# EAGLE design supertrack (EAGLE 7.0.0)
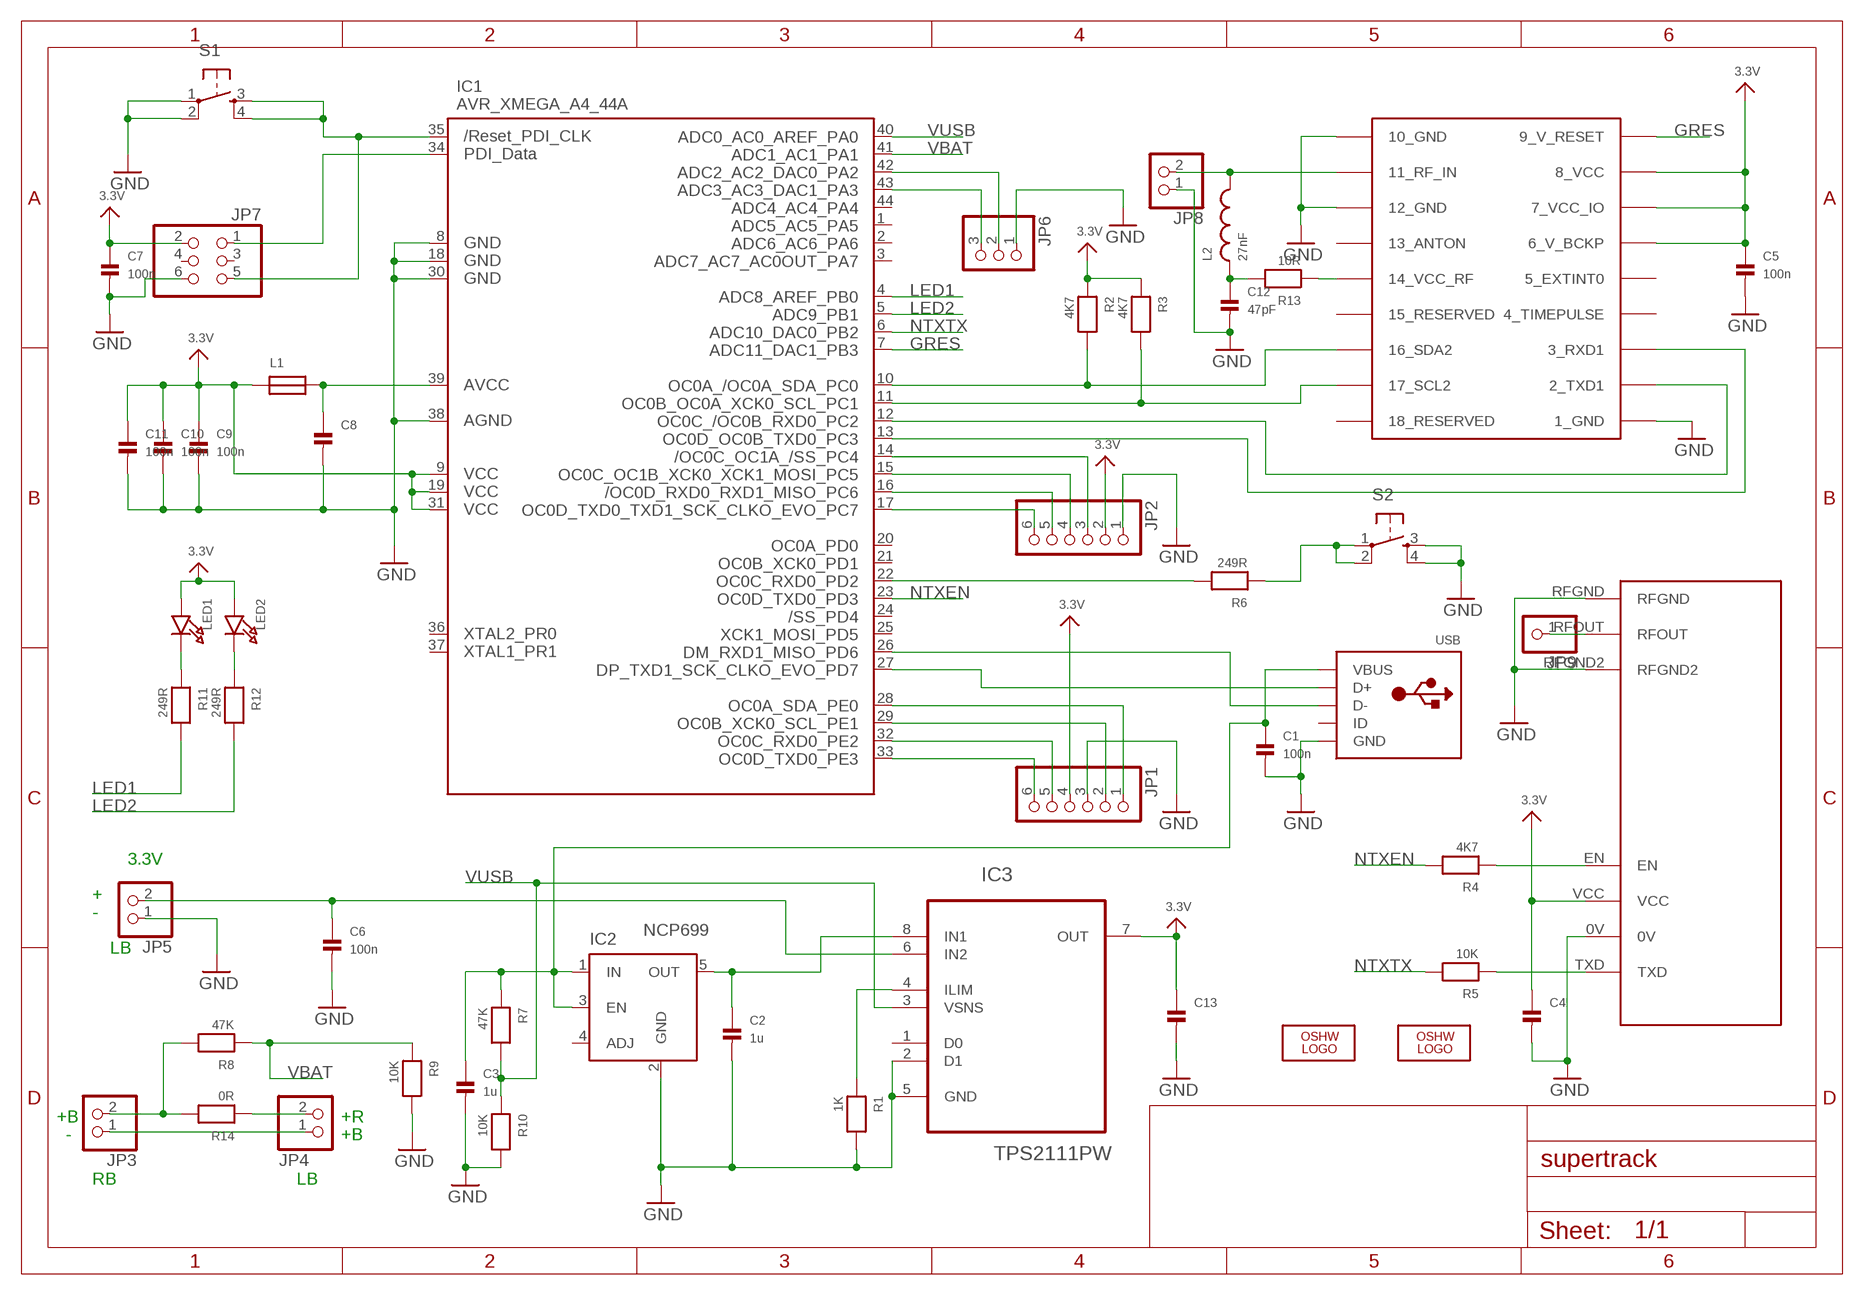
[diagram p0: schematic, sheet 1]

## Parts
C1  100n  CAP_CERAMIC0603  [0603]
C2  1u  CAP_CERAMIC0603  [0603]
C3  1u  CAP_CERAMIC0603  [0603]
C4  CAP_CERAMIC0603  [0603]
C5  100n  CAP_CERAMIC0603  [0603]
C6  100n  CAP_CERAMIC0603  [0603]
C7  100n  CAP_CERAMIC0603  [0603]
C8  CAP_CERAMIC0603  [0603]
C9  100n  CAP_CERAMIC0603  [0603]
C10  100n  CAP_CERAMIC0603  [0603]
C11  100n  CAP_CERAMIC0603  [0603]
C12  47pF  CAP_CERAMIC0603  [0603]
C13  CAP_CERAMIC0603  [0603]
IC1  AVR_XMEGA_A4_44A  [TQFP44]
IC2  NCP699  MIC5219BM5  [SOT23-5]
IC3  TPS2111PW  [SOP65P640X120-8N]
JP1  PINHD-1X6  [1X06]
JP2  PINHD-1X6  [1X06]
JP3  PINHD-1X2  [1X02]
JP4  PINHD-1X2  [1X02]
JP5  PINHD-1X2  [1X02]
JP6  PINHD-1X3  [1X03]
JP7  PINHD-2X3  [2X03]
JP8  HEADER-1X2ROUND  [1X02_ROUND]
JP9  HEADER-1X1ROUND  [1X01_ROUND]
L1  FERRITE  [0603]
L2  27nF  INDUCTOR0603  [0603]
LED1  LED0603  [CHIPLED_0603]
LED2  LED0603  [CHIPLED_0603]
LOGO1  OSHW_LOGO_8MILX0150-NT  [OSHW_8X150_NOTEXT]
LOGO2  OSHW_LOGO_8MILX0100-NT  [OSHW_8X100_NOTEXT]
R1  1K  RESISTOR0603  [0603]
R2  4K7  RESISTOR0603  [0603]
R3  4K7  RESISTOR0603  [0603]
R4  4K7  RESISTOR0603  [0603]
R5  10K  RESISTOR0603  [0603]
R6  249R  RESISTOR0603  [0603]
R7  47K  RESISTOR0603  [0603]
R8  47K  RESISTOR0603  [0603]
R9  10K  RESISTOR0603  [0603]
R10  10K  RESISTOR0603  [0603]
R11  249R  RESISTOR0603  [0603]
R12  249R  RESISTOR0603  [0603]
R13  10R  RESISTOR0603  [0603]
R14  0R  RESISTOR0603  [0603]
S1  TAC_SWITCHSMD  [TACTILE_SWITCH_SMD]
S2  TAC_SWITCHSMD  [TACTILE_SWITCH_SMD]
U$1  NTX2  [NTX2]
U$2  UBLOX_MAX  [UBLOX_MAX]
USB  USBMINIB  [USB-MINIB]

## Nets
3.3V: C4.1 C5.1 C7.1 C9.1 C10.1 C11.1 C13.1 IC1.9(VCC1) IC1.19(VCC2) IC1.31(VCC3) IC3.7(OUT) JP1.4 JP2.2 JP7.2 L1.1 LED1.A LED2.A R2.1 R3.1 U$1.VCC U$2.6_V_BCKP U$2.7_VCC_IO U$2.8_VCC
GND: C1.2 C2.2 C3.2 C4.2 C5.2 C6.2 C7.2 C8.2 C9.2 C10.2 C11.2 C12.2 C13.2 IC1.8(GND1) IC1.18(GND2) IC1.30(GND3) IC1.38(AGND) IC2.2(GND) IC3.2(D1) IC3.5(GND) JP1.3 JP2.1 JP5.1 JP6.1 JP7.6 JP8.1 R1.2 R9.2 R10.2 S1.1 S1.2 S2.3 S2.4 U$1.0V U$1.RFGND U$1.RFGND2 U$2.1_GND U$2.10_GND U$2.12_GND USB.GND
GRES: IC1.7(PB3) U$2.9_V_RESET
LED1: IC1.4(PB0) R11.2
LED2: IC1.5(PB1) R12.2
N$1: C2.1 IC2.5(OUT) IC3.8(IN1)
N$2: IC1.33(PE3) JP1.6
N$3: IC1.32(PE2) JP1.5
N$4: C6.1 IC3.6(IN2) JP5.2
N$5: R6.1 S2.1 S2.2
N$6: IC1.26(PD6) USB.D-
N$7: IC1.27(PD7) USB.D+
N$8: IC1.22(PD2) R6.2
N$9: R5.1 U$1.TXD
N$10: R4.1 U$1.EN
N$11: JP9.1 U$1.RFOUT
N$12: C1.1 C3.1 IC2.1(IN) IC2.3(EN) R7.1 USB.VBUS
N$14: IC3.4(ILIM) R1.1
N$16: IC1.10(PC0) R2.2 U$2.16_SDA2
N$17: IC1.11(PC1) R3.2 U$2.17_SCL2
N$18: IC1.12(PC2) U$2.2_TXD1
N$19: IC1.13(PC3) U$2.3_RXD1
N$20: LED2.C R12.1
N$22: LED1.C R11.1
N$23: IC1.29(PE1) JP1.2
N$25: IC1.28(PE0) JP1.1
N$27: IC1.17(PC7) JP2.6
N$28: IC1.16(PC6) JP2.5
N$29: IC1.15(PC5) JP2.4
N$30: IC1.14(PC4) JP2.3
N$31: JP3.1 JP4.1
N$32: JP4.2 R14.1
N$33: IC1.34(PDI_DATA) JP7.1
N$35: IC1.35(RESET) JP7.5 S1.3 S1.4
N$36: IC1.42(PA2) JP6.2
N$37: IC1.43(PA3) JP6.3
N$38: JP8.2 L2.2 U$2.11_RF_IN
N$39: C12.1 L2.1 R13.2
N$40: R13.1 U$2.14_VCC_RF
N$41: C8.1 IC1.39(AVCC) L1.2
NTXEN: IC1.23(PD3) R4.2
NTXTX: IC1.6(PB2) R5.2
VBAT: IC1.41(PA1) R8.1 R9.1
VIN: JP3.2 R8.2 R14.2
VUSB: IC1.40(PA0) IC3.3(VSNS) R7.2 R10.1
Unconnected: IC1.1(PA5) IC1.2(PA6) IC1.3(PA7) IC1.20(PD0) IC1.21(PD1) IC1.24(PD4) IC1.25(PD5) IC1.36(PR0) IC1.37(PR1) IC1.44(PA4) IC2.4(ADJ) IC3.1(D0) JP7.3 JP7.4 U$2.4_TIMEPULSE U$2.5_EXTINT0 U$2.13_ANTON U$2.15_RESERVED U$2.18_RESERVED USB.ID

## Notes on the sheet
- 3.3V
- +
- -
- LB
- +B | +R
- - | +B
- RB | LB

## Library data of the parts
C1-C13 = microbuilder:CAP_CERAMIC: Ceramic Capacitors 0402 - 0402 Surface Mount Capacitors 0.1uF 10V 10% [Digikey: 490-1318-2-ND] 0603 - 0603 Surface Mount Capacitors 16 pF 50V 5% [Digikey: 445-5051-2-ND] 22 pF 50V [Digikey: PCC220ACVTR-ND] 33 pF 50V 5% [Digikey: 490-1415-1-ND] 56pF 50V 5% [Digikey: 490-1421-1-ND] 220pF 50V 5% [Digikey: 445-1285-1-ND] 680 pF 50V 2200 pF 50V 5% C0G [Digikey: 445-1297-1-ND] 5600 pF 100V 5% X7R [Digikey: 478-3711-1-ND] 0.1 µF 25V 10% [Digikey: PCC2277TR-ND] 0.22 µF 16V 10% X7R [Digikey: 445-1318-1-ND] 1.0 µF 25V 10% [Digikey: 445-5146-2-ND] 0603 - RF Specific 3pF 250V +/-0.1pF RF [Digikey: 712-1347-1-ND] 18 pF 250V 5% [Digikey: 478-3505-1-ND or 712-1322-1-ND] 56 pF 250V 5% C0G RF [Digikey: 490-4867-1-ND] 68 pF 250V RF [Digikey: 490-4868-1-ND] 0805 - 0805 Surface Mount Capacitors 220 pF 250V 2% RF Ceramic Capacitor [Digikey: 712-1398-1-ND] 1000 pF 50V 2% NP0 Ceramic Capacitor [Digikey: 478-3760-1-ND] 0.1 µF 25V 10% Ceramic Capacitor [Digikey: PCC1828TR-ND] 1.0 µF 16V 10% Ceramic Capacitor[Digikey: 490-1691-2-ND] 10.0 µF 10V 10% Ceramic Capacitor[Digikey: 709-1228-1-ND] 1206 - 1206 Surface Mount Capacitors
IC1 = xmega:AVR_XMEGA_A4_: Device for Atmel AVR XMEGA A4 Series
IC2 = v-reg-micrel:MIC5219BM5: VOLTAGE REGULATOR; MF: ALTERA CORPORATION; MPN: MIC5219BM5 TR; OC_FARNELL: 1100656; OC_NEWARK: 09J8939
IC3 = Texas Instruments_By_element14_Batch_1:TPS2111PW: AUTOSWITCHING POWER MUX; MPN: TPS2111PW; OC_FARNELL: -; OC_NEWARK: 22H1359; PACKAGE: TSSOP-8; SUPPLIER: TEXAS INSTRUMENTS
JP1 JP2 = pinhead:PINHD-1X6: PIN HEADER
JP3-JP5 = pinhead:PINHD-1X2: PIN HEADER
JP6 = pinhead:PINHD-1X3: PIN HEADER
JP7 = pinhead:PINHD-2X3: PIN HEADER
JP8 = microbuilder:HEADER-1X2: PIN HEADER
JP9 = microbuilder:HEADER-1X1: PIN HEADER
L1 = microbuilder:FERRITE: Ferrite Bead 0603 120 Ohm, 600mA Ferrite Chip - Digikey: 445-2164-1-ND
L2 = microbuilder:INDUCTOR: Inductors 0603: 10nH Ceramic Inductor - microwire antenna/RF (Digikey: 712-1434-2-ND) 0805: 560nH Ceramic Inductor - RF (Digikey: 553-1047-1-ND) 1007 (2518 Metric) SMT: 10µH 10% 250mOhm 820mA 1007 Inductor (Digikey: 587-2189-1-ND) 22µH 10% 500mOhm 580mA 1007 Inductor (Digikey: 587-2190-1-ND) 47µH 10% 950mOhm 420mA 1007 Inductor (Digikey: 587-2191-1-ND) 47µH 5% 100mOhm 1A 1008 Inductor (Digikey: 732-1816-1-ND)
LED1 LED2 = microbuilder:LED: LED 0603 - 0603 Surface Mount Package Green LED - Low Power (3.9mcd, 2ma, 1.7Vf) Orange LED - Low Power (9.8mcd, 2ma, 1.8Vf) Red LED - Low Power (5mcd, 2ma, 1.8Vf) Yellow LED - Low Power (7mcd, 2ma, 1.8Vf) 0805 - 0805 Surface Mount Package 20mA: Red LED (104mcd, 20mA, Diffused) - LS R976 [Digikey: 475-1278-6-ND] Red LED (12mcd, 20mA, 2.0Vf, Clear) - APT2012EC [Digikey: 754-1128-1-ND] Green LED (15mcd, 20mA, 2.2Vf, Clear) - APT2012GC [Digikey: 754-1131-1-ND] Orange LED (160mcd, 20mA, 2.1Vf, Clear) - APT2012SECK [Digikey: 754-1130-1-ND] 2mA: Red LED (8.8mcd, 2mA, 1.8Vf, Clear) - Low Power [Digikey: 475-2510-1-ND] Green LED (5mcd, 2mA, 1.8Vf, Clear) - Low Power [Digikey: 475-2730-1-ND] Yellow LED (11.3mcd, 2mA, 1.8Vf, Clear) - Low Power [Digikey: 475-2555-1-ND] 1206 - 1206 Surface Mount Package Green LED (26mcd, 20mA, Diffused) - LG N971 [Digikey: 475-1407-6-ND] Red LED (15mcd, 20mA, Diffused) - LH N974 [Digikey: 475-1416-6-ND]
LOGO1 LOGO2 = ohw-logo:OSHW_LOGO_8MIL
R1-R14 = microbuilder:RESISTOR: Resistors 0402 - 0402 Surface Mount Package 10.0K 1% 1/16W [Digikey: 311-10.0KLRTR-ND] 0603 - 0603 Surface Mount Package 0 Ohm 1/10 Watt 1% Resistor 15 Ohm 1/10 Watt 1% Resistor 33 Ohm 1/10 Watt 1% Resistor 49.9 Ohm 1/10 Watt 1% Resistor 100 Ohm 1/10 Watt 1% Resistor 150 Ohm 1/10 Watt 1% Resistor 240 Ohm 1/10 Watt 1% Resistor 390 Ohm 1/10 Watt 1% Resistor 560 Ohm 1/10 Watt 1% Resistor 750 Ohm 1/10 Watt 1% Resistor 1.0K Ohm 1/10 Watt 1% Resistor 1.5K Ohm 1/10 Watt 1% Resistor 2.0K Ohm 1/10 Watt 1% Resistor 4.7K Ohm 1/10 Watt 1% Resistor 10.0K Ohm 1/10 Watt 1% Resistor 20.0K Ohm 1/10 Watt 1% Resistor 33.0K Ohm 1/10 Watt 1% Resistor 100.0K Ohm 1/10 Watt 1% Resistor 0805 - 0805 Surface Mount Package 0 Ohm 1/8 Watt 1% Resistor 33 Ohm 1/8 Watt 1% Resistor 100 Ohm 1/8 Watt 1% Resistor 150 Ohm 1/8 Watt 1% Resistor 200 Ohm 1/8 Watt 1% Resistor 240 Ohm 1/8 Watt 1% Resistor 330 Ohm 1/8 Watt 1% Resistor 390 Ohm 1/8 Watt 1% Resistor 470 Ohm 1/8 Watt 1% Resistor 1.0K Ohm 1/8 Watt 1% Resistor 1.5K Ohm 1/8 Watt 1% Resistor 2.0K Ohm 1/8 Watt 1% Resistor 4.7K Ohm 1/8 Watt 1% Resistor 5.1K Ohm 1/8 Watt 1% Resistor 5.6K Ohm 1/8 Watt 1% Resistor 10.0K Ohm 1/8 Watt 1% Resistor 22.0K Ohm 1/8 Watt 1% Resistor 33.0K Ohm 1/8 Watt 1% Resistor 100K Ohm 1/8 Watt 1% Resistor 1206 - 1206 Surface Mount Package
S1 S2 = SparkFun:TAC_SWITCH: Momentary Switch Button commonly used for reset or general input. Spark Fun Electronics SKU : COM-00097
U$1 = Ava:NTX2: Radiometrix NTX2 Transmitter Module Author Anthony Stirk / http://ava.upuaut.net
U$2 = Ava:UBLOX_MAX: UBLOX MAX
USB = adafruit:USB: USB Connectors USBMINIB - Surface Mount Female Mini-B USB Connector 4UConnector: 06564 By microbuilder.eu Thru-hole RA Female Mini-B USB Connector 4UConnector: 18732 By ladyada.net

## Board
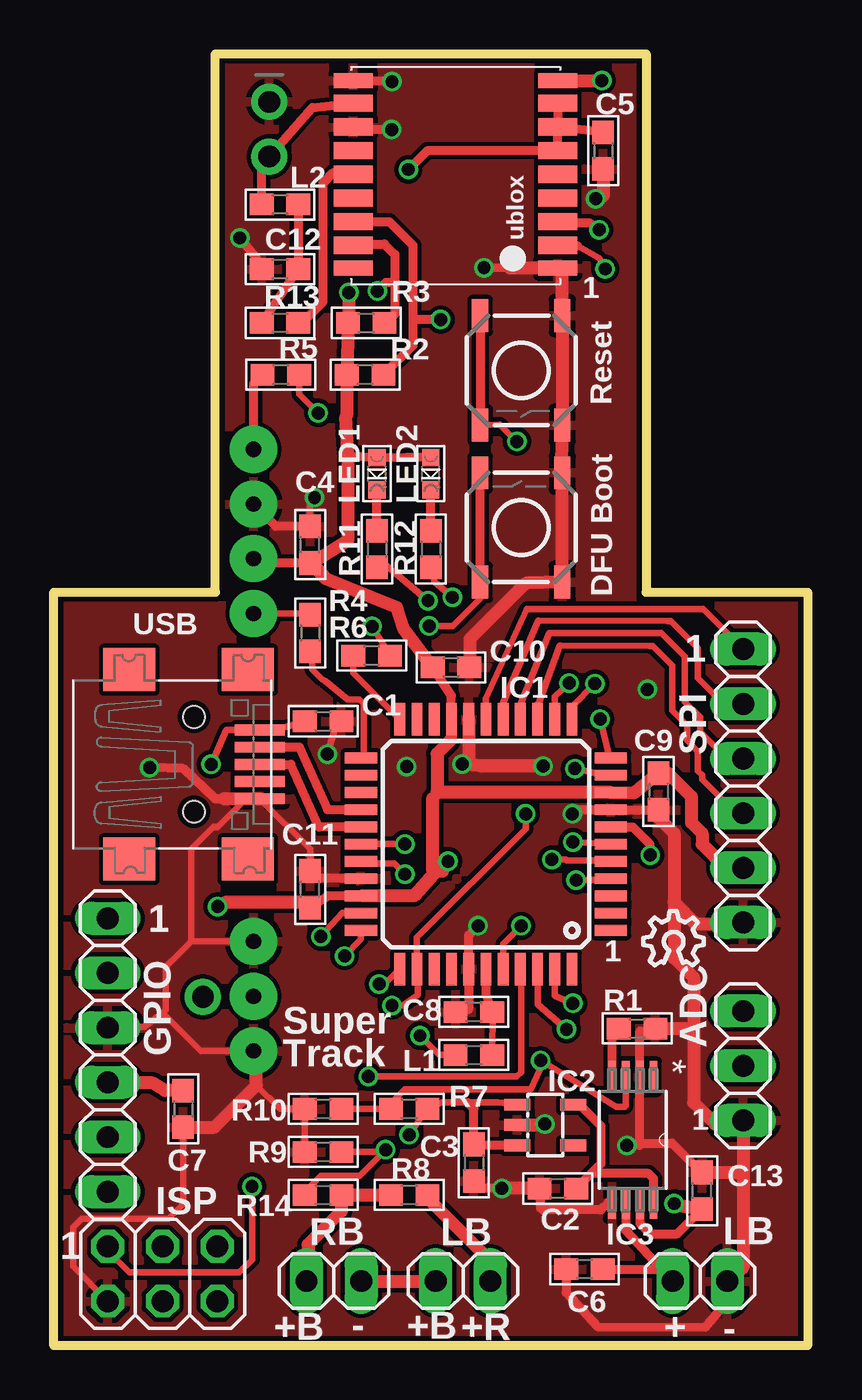
[diagram p1: board, top side]
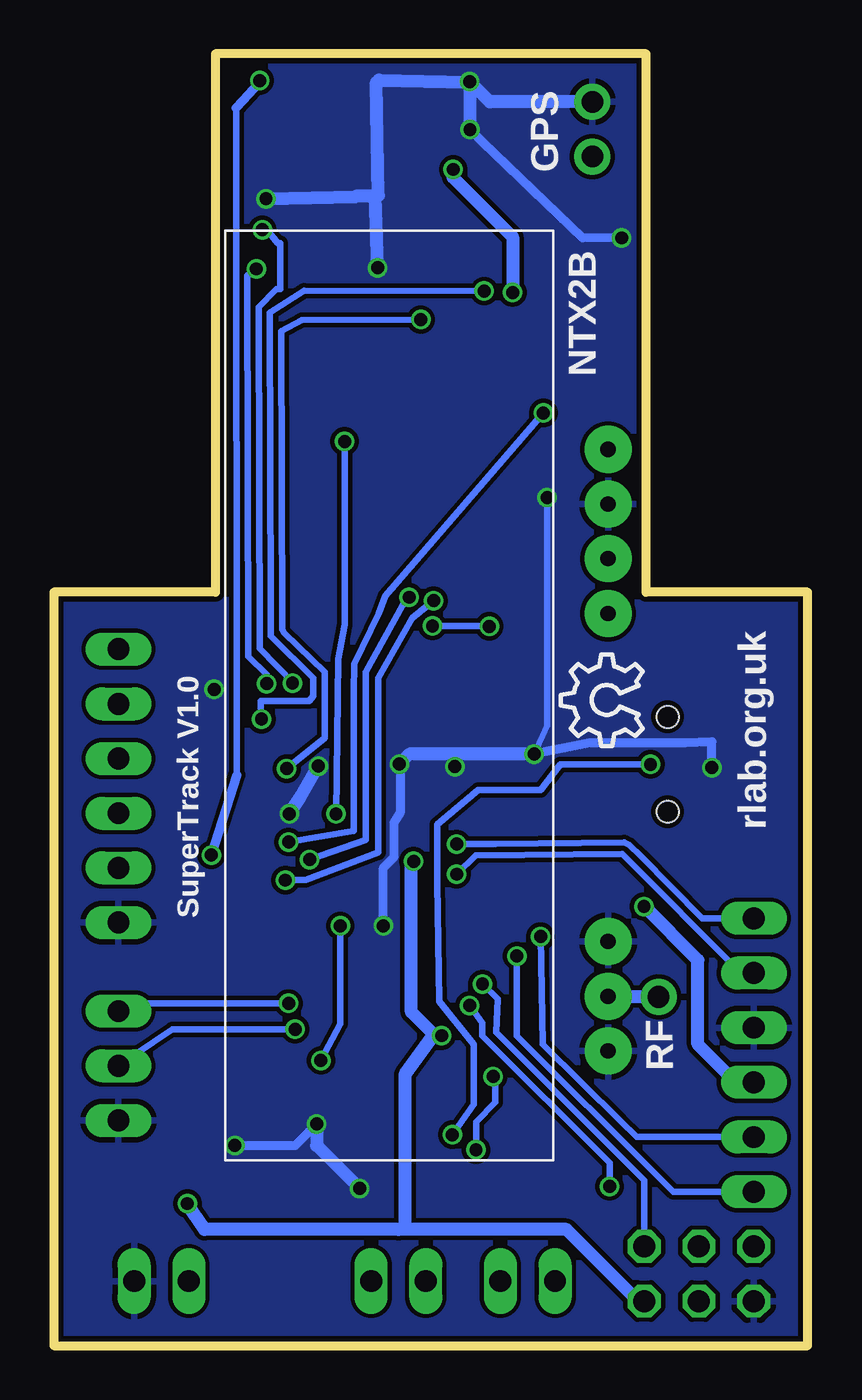
[diagram p2: board, bottom side, seen from below]

Size 35 x 60 mm. Coordinates in mm from the lower left corner, seen from the top.
Outline: 0,0 0,35 7.5,35 7.5,60 27.5,60 27.5,35 35,35 35,0 0,0
Copper layers (1*16): Top 0.035mm / dielectric 1.5mm / Bottom 0.035mm
Design rules "dirt_cheap_dirty_boards.v1 *": minimum track width 5mil, minimum drill 12mil, track to track 8mil, track to pad 8mil, pad to pad 8mil, via to via 8mil, smd to smd 0mil, copper to edge 10mil, drill to drill 10mil, minimum pad ring 10mil, minimum via ring 6mil, stop-mask expansion 2mil, vias tented up to drill 25mil, thermal gap 10mil

### Footprints (pad centres in the part's own frame; a part is rotated, then mirrored left to right if it is on the bottom)
0603 = smd 1.1 x 1: 1 -0.85,0; 2 0.85,0
TQFP44 = smd 1.5 x 0.5: 1 -5.8,4; 2 -5.8,3.2; 3 -5.8,2.4; 4 -5.8,1.6; 5 -5.8,0.8; 6 -5.8,0; 7 -5.8,-0.8; 8 -5.8,-1.6; 9 -5.8,-2.4; 10 -5.8,-3.2; 11 -5.8,-4; 23 5.8,-4; 24 5.8,-3.2; 25 5.8,-2.4; 26 5.8,-1.6; 27 5.8,-0.8; 28 5.8,0; 29 5.8,0.8; 30 5.8,1.6; 31 5.8,2.4; 32 5.8,3.2; 33 5.8,4 | smd 0.5 x 1.5: 12 -4,-5.8; 13 -3.2,-5.8; 14 -2.4,-5.8; 15 -1.6,-5.8; 16 -0.8,-5.8; 17 0,-5.8; 18 0.8,-5.8; 19 1.6,-5.8; 20 2.4,-5.8; 21 3.2,-5.8; 22 4,-5.8; 34 4,5.8; 35 3.2,5.8; 36 2.4,5.8; 37 1.6,5.8; 38 0.8,5.8; 39 0,5.8; 40 -0.8,5.8; 41 -1.6,5.8; 42 -2.4,5.8; 43 -3.2,5.8; 44 -4,5.8
SOT23-5 = smd 0.55 x 1.2: 1 -0.95,-1.3; 2 0,-1.3; 3 0.95,-1.3; 4 0.95,1.3; 5 -0.95,1.3
SOP65P640X120-8N = smd 1.473 x 0.356: 1 -2.921,0.965; 2 -2.921,0.33; 3 -2.921,-0.33; 4 -2.921,-0.965; 5 2.921,-0.965; 6 2.921,-0.33; 7 2.921,0.33; 8 2.921,0.965
1X06 = drill 1.016 long: 1 -6.35,0; 2 -3.81,0; 3 -1.27,0; 4 1.27,0; 5 3.81,0; 6 6.35,0
1X02 = drill 1.016 long: 1 -1.27,0; 2 1.27,0
1X03 = drill 1.016 long: 1 -2.54,0; 2 0,0; 3 2.54,0
2X03 = drill 1.016 octagon: 1 -2.54,-1.27; 2 -2.54,1.27; 3 0,-1.27; 4 0,1.27; 5 2.54,-1.27; 6 2.54,1.27
1X02_ROUND = drill 1 pad 1.676: 1 -1.27,0; 2 1.27,0
1X01_ROUND = drill 1 pad 1.676: 1 0,0
CHIPLED_0603 = smd 0.8 x 0.8: A 0,-0.75; C 0,0.75
TACTILE_SWITCH_SMD = smd 1.524 x 0.762: 1 -2.54,1.905; 2 2.54,1.905; 3 -2.54,-1.905; 4 2.54,-1.905
NTX2 = drill 0.7 pad 2.184: 0V -2.54,-10.16; EN -7.62,-10.16; RFGND -22.86,-10.16; RFGND2 -27.94,-10.16; RFOUT -25.4,-10.16; TXD 0,-10.16; VCC -5.08,-10.16
UBLOX_MAX = smd 1.8 x 0.7: 1_GND 4.95,-4.4; 9_V_RESET 4.95,4.3; 10_GND -4.55,4.3; 18_RESERVED -4.55,-4.4 | smd 1.8 x 0.8: 2_TXD1 4.95,-3.35; 3_RXD1 4.95,-2.25; 4_TIMEPULSE 4.95,-1.15; 5_EXTINT0 4.95,-0.05; 6_V_BCKP 4.95,1.05; 7_VCC_IO 4.95,2.15; 8_VCC 4.95,3.25; 11_RF_IN -4.55,3.25; 12_GND -4.55,2.15; 13_ANTON -4.55,1.05; 14_VCC_RF -4.55,-0.05; 15_RESERVED -4.55,-1.15; 16_SDA2 -4.55,-2.25; 17_SCL2 -4.55,-3.35
USB-MINIB = smd 0.5 x 2.308: D+ 0,4.064; D- -0.8,4.064; GND 1.6,4.064; ID 0.8,4.064; VBUS -1.6,4.064 | smd 2 x 2.4: GND1 -4.4,-2; GND2 -4.4,3.5; GND3 4.4,3.5; GND4 4.4,-2 | hole 1: -2.2,1; 2.2,1

### Placement (x,y rotation side)
C1  12.5,29 0 top
C2  23.4,7.3 180 top
C3  19.5,8.5 270 top
C4  11.9,37.2 90 top
C5  25.5,55.5 270 top
C6  24.64,3.56 180 top
C7  6,11 270 top
C8  19.5,15.5 180 top
C9  28.07,25.74 270 top
C10  18.44,31.5 0 top
C11  11.9,21.2 90 top
C12  10.5,50 180 top
C13  30.1,7.2 90 top
IC1  20.06,23.29 180 top
IC2  22.82,10.25 270 top
IC3  26.88,9.56 270 top
JP1  2.5,13.5 270 top
JP2  32,26 90 top
JP3  13,3 180 top
JP4  19,3 0 top
JP5  30,3 180 top
JP6  32,13 90 top
JP7  5.05,3.34 180 top
JP8  10,56.5 270 top
JP9  6.92,16.2 0 top
L1  19.5,13.5 0 top
L2  10.5,53 180 top
LED1  15,40.5 180 top
LED2  17.5,40.5 180 top
LOGO1  7.65,27.86 90 bottom
LOGO2  27.36,17.65 0 top
R1  27.08,14.73 0 top
R2  14.45,45.1 0 top
R3  14.5,47.5 0 top
R4  11.9,33.1 270 top
R5  10.54,45.1 0 top
R6  14.75,32.05 180 top
R7  16.5,11 180 top
R8  12.5,7 0 top
R9  12.5,9 180 top
R10  12.5,11 180 top
R11  15,37 270 top
R12  17.5,37 270 top
R13  10.5,47.5 180 top
R14  16.5,7 180 top
S1  21.7,45.3 270 top
S2  21.7,38 90 top
U$1  19.43,41.63 90 bottom
U$2  18.45,54.45 0 top
USB  5.5,27 270 top

### Tracks (layer width: path | path; a pad name or v marks a point on that pad's centre or on a via)
3.3V  (via drill 0.6)
  Top 0.305: 13.6,43.29 13.7,43.19 13.56,43.15 | 17.66,41.3 LED2.A | 13.74,41.3 13.66,41.22 | L1.1 17.9,13.5 v17,14.4
  Top 0.406: C11.1 12.74,20.89 IC1.31 14.35,20.9 | IC1.19 18.46,30.19 C10.1 | U$2.8_VCC U$2.7_VCC_IO | C5.1 U$2.7_VCC_IO | U$1.VCC 9.46,36.36 C4.1 11.98,36.34 | 13.62,45.1 R2.1 | U$2.7_VCC_IO U$2.6_V_BCKP 17.33,55.5 v16.46,54.63 | IC1.19 | 17.57,25.41 17.85,25.69 17.8,25.74 | 17.57,22.11 17.64,22.04 17.64,21.91 | 17.66,41.3 LED1.A 13.74,41.3 | IC3.7 27.21,5.69 27.7,5.2 28.95,5.2 C13.1 | IC1.19 18.5,29.09 18.5,28.1 18.4,28.1
  Top 0.61: 13.62,45.1 R3.1 13.7,47.49 v13.7,48.91 | 17.85,25.69 IC1.9 26.93,25.68 C9.1 28.51,26.59 29.6,25.5 29.6,24.3 30.1,23.8 30.1,23.3 31.2,22.2 JP2.2 | 17.57,25.41 17.57,22.11 | 17.64,21.91 16.73,20.9 14.35,20.9 | R2.1 13.6,43.29 | 13.56,43.15 13.66,41.22 13.66,37.42 11.98,36.34 12.62,35.64 15.9,34.3 16.2,33.36 C10.1 | 17.64,22.04 18.04,22.04 v18.3,22.5 | 18.4,28.1 17.8,27.5 17.8,25.74 | v28.8,6.6 29.4,6.45 C13.1 | C7.1 5.15,11.85 4.6,12.2 2.57,12.2 JP1.4 | v7.6,20.4 7.8,20.4 8,20.6 11.65,20.6 C11.1
  Bottom 0.305: v17,14.4 17.3,14.4 17.4,14.4 | 18.4,22.4 v18.3,22.5 | 18.7,5.5 19,5.4
  Bottom 0.61: v16.46,54.63 16.46,54.25 13.7,51.49 v13.7,48.91 | 17.3,14.4 18.4,15.5 18.4,22.4 | v28.8,6.6 28,5.4 19,5.4 11.2,5.4 7.87,2.07 JP7.2 | 17.4,14.4 18.7,12.6 18.7,5.5 | JP1.4 3.33,12.23 5.1,14 5.1,17.9 v7.6,20.4
GND  (via drill 0.6)
  Top 0.305: C1.2 13.02,28.53 v12.7,27.48 | C4.2 11.89,39.18 v12.1,39.39 | 24.08,24.89 v24.07,24.7 | 27.21,14.61 R1.2 | 27.2,9.3 27.2,9.4 | IC3.2 | R10.2 11.64,10.76 | 30,8.1 30.1,8.1 | 6.37,18.77 5.2,17.6 5.2,15.6 5.05,15.45 | 5.05,15.45 4.2,14.8 2.77,14.8 JP1.3 | U$1.RFGND2 6.81,13.69 5.05,15.45 | C7.2 6,6.6 5.3,5.9 1.3,5.9 0.9,5.5 0.9,3.68 JP7.6 | R9.2 R10.2 | R10.2 10.5,11 9.4,12.1 | 6.37,18.77 U$1.RFGND | C11.2 11.9,23.06 USB.GND | 6.37,18.77 6.37,23.07 7.4,24.1 7.6,24.1 8.9,25.4
  Top 0.406: IC1.30 12.16,21.69 C11.2 | C9.2 IC1.8 24.08,24.89 | C8.2 19.26,15.61 IC1.38 19.26,19.06 v19.7,19.5 | C4.2 10.3,38.06 U$1.0V | S2.4 23.57,40.22 | 23.59,49.85 U$2.1_GND | U$2.10_GND 15.66,58.75 v15.7,58.71 | v15.68,56.48 14.02,56.48 U$2.12_GND | C12.2 9.65,50.21 v8.64,51.45 | 21.18,50.05 v19.97,50.06 | 19.32,31.6 C10.2 | IC3.2 27.21,14.61 | IC3.2 27.2,9.4 28.7,9.4 30,8.1 | 7.9,25.4 7.5,25.4 6,26.8 v4.45,26.85 | v20.8,7.3 19.85,7.3 C3.2 | IC3.5 25.74,6.64 25.4,6.3 22.7,6.3 22.6,6.4 22.6,7.25 C2.2 | 27.2,9.3 v26.6,9.3 | C6.2 23.79,2.48 25.25,0.89 30.25,0.86 31.39,2.23 31.39,2.88 JP5.1
  Top 0.61: S2.4 S2.3 21.91,35.41 19.32,32.82 19.32,31.6 | 23.57,40.22 S1.2 S1.1 23.59,49.85 | C5.2 25.5,53.39 v25.15,53.27 | 23.37,50.02 U$2.1_GND 21.18,50.05 | v22.72,26.92 19.85,26.92 v18.96,27.01 19.26,27.31 IC1.18 | USB.GND 8.9,25.4 7.9,25.4 | 32,8.2 JP6.1 31.84,10.3 30.7,10.3 29.7,11.3 29.7,14.7 | 32,8.2 32,3.65 JP5.1 | C13.2 31.85,8.05 32,8.2 | IC2.2 22.75,10.25 v22.8,10.3 | C2.2 v20.8,7.3 | C9.2 28.07,24.53 28.8,23.8 28.8,20.6 | 28.8,20.6 29.8,19.6 31.95,19.6 JP2.1 | 28.8,20.6 28.8,18 29.7,17.1 29.7,14.7 | R1.2 29.67,14.73 29.7,14.7 | C7.2 7.45,10.15 9.4,12.1 9.4,13.56 U$1.RFGND2
  Bottom 0.305: v12.1,39.39 12.1,28.81 v12.7,27.48 | 18.9,26.95 v18.96,27.01
  Bottom 0.406: 15.7,56.5 v15.68,56.48 10.44,51.44 v8.64,51.45 | 20.03,58.66 19.91,58.78 | 15.73,58.68 v15.7,58.71 | 20.07,53.38 19.93,53.42 | v19.7,19.5 19.7,22.2 19.2,22.7 19.2,24.3 18.9,24.8 18.9,26.95 | v4.45,26.85 4.45,28.05 5.7,28 10.11,28 v12.7,27.48 | v26.6,9.3 23.8,9.3 v22.8,10.3
  Bottom 0.61: v25.15,53.27 20.97,53.37 20.93,53.41 19.93,53.42 20.03,58.66 | 15.7,56.5 v15.7,58.71 14.76,57.77 JP8.1 | 19.91,58.78 15.73,58.68 | v19.97,50.06 20.07,53.38 | v24.07,24.7 23.57,25.47 v22.72,26.92 | v12.7,27.48 18.49,27.48 v18.96,27.01 | v22.8,10.3 22.8,9.3 v20.8,7.3
  other vias: 27.56,30.48 16.38,26.9
  pour Top: 0,0 0,35 7.5,35 7.5,60 27.5,60 27.5,35 35,35 35,0
  pour Bottom: 0,0 0,35 7.5,35 7.5,60 27.5,60 27.5,35 35,35 35,0
GRES  (via drill 0.6)
  Top 0.406: v27.69,22.79 27.69,23.27 26.89,24.07 25.88,24.07 IC1.7
  Top 0.61: U$2.9_V_RESET v25.43,58.75 v25.44,58.76
  Bottom 0.305: 26.54,57.49 26.5,26.5
  Bottom 0.406: 25.44,58.68 26.54,57.49 | 26.5,26.5 v27.69,22.79
  Bottom 0.61: v25.44,58.76 25.44,58.68
LED1  (via drill 0.6)
  Top 0.305: R11.2 15.42,36.25 v17.37,34.6 | v24.25,21.62 25.79,21.62 IC1.4
  Bottom 0.305: v17.37,34.6 18.36,33.8 19.94,31.02 19.94,22.9 23.31,21.63 v24.24,21.63 v24.25,21.62
LED2  (via drill 0.6)
  Top 0.305: R12.2 17.69,35.47 v18.5,34.76 | v23.12,22.58 23.77,22.58 23.81,22.54 25.81,22.54 IC1.5
  Bottom 0.305: v18.5,34.76 18.8,34.4 20.52,31.28 20.52,23.48 v23.12,22.58
N$1
  Top 0.305: C2.1 24.11,7.41
  Top 0.406: IC2.5 24.4,11.2 25.4,10.2 25.4,8.45 24.98,8.03 | 24.98,8.03 C2.1 | IC3.8 27.84,7.75 27.6,8 25,8 24.98,8.03
N$2  (via drill 0.6)
  Top 0.305: IC1.33 14.26,18.86 v13.5,18.1
  Bottom 0.305: v13.5,18.1 13.5,14.4 6.95,7.85 6.8,7.7 6.25,7.15 JP1.6
N$3  (via drill 0.6)
  Top 0.305: IC1.32 13.39,20.09 v12.4,19
  Bottom 0.305: v12.4,19 12.3,14 8.7,10.45 7.94,9.69 JP1.5
N$4
  Top 0.406: IC3.6 26.55,5.36 28.37,3.39 | 28.37,3.39 JP5.2 | C6.1 28.37,3.56 28.37,3.39
N$5  (via drill 0.6)
  Top 0.305: 19.82,35.12 S2.1 19.8,35.4 19.8,34.7 18.53,33.43 v17.42,33.43 | v14.78,33.41 15.39,32.42 R6.1
  Top 0.406: S2.1 S2.2
  Bottom 0.305: v17.42,33.43 15,33.43 v14.78,33.41
N$6
  Top 0.406: USB.D- 11.4,27.8 12.71,24.89 IC1.26
N$7
  Top 0.406: USB.D+ 11,27 12.31,24.09 IC1.27
N$8
  Top 0.305: R6.2 13.9,31.25 IC1.22
N$9
  Top 0.406: U$1.TXD 9.27,44.67 R5.1
N$10
  Top 0.305: U$1.EN 11.86,34.01 R4.1
N$11
  Bottom 0.305: 9.24,16.2 U$1.RFOUT
  Bottom 0.61: JP9.1 9.24,16.2
N$12  (via drill 0.6)
  Top 0.305: C1.1 10.29,28.6 USB.VBUS 8,28.6 v7.3,27 | IC2.1 20.6,11.3 19.2,11.3 18,11.3 R7.1 17.3,10.95 v16.5,9.8
  Top 0.406: IC2.3 19.55,9.3 C3.1 19.5,11 19.2,11.3
  Bottom 0.305: v7.3,27 11.5,27 12.4,25.8 15.3,25.8 17.2,24.2 17.2,21.5 17.1,16 15.5,14 15.5,11.2 v16.5,9.8
N$14
  Top 0.305: 25.91,14.45 R1.1
  Top 0.406: IC3.4 25.91,14.45
N$16  (via drill 0.6)
  Top 0.305: v24.19,26.8 25.81,26.44 IC1.10
  Top 0.406: U$2.16_SDA2 15.58,52.2 16.67,51.11 16.67,47.68 | 16.67,47.68 16.67,46.45 R2.2 | 16.67,47.68 17.94,47.68 v17.96,47.66
  Bottom 0.305: v17.96,47.66 23.5,47.64 24.44,47.13 24.39,33.26 24.31,33.09 22.42,31.3 22.42,28.23 v24.19,26.8
N$17  (via drill 0.6)
  Top 0.305: v25.36,29.1 25.78,27.37 IC1.11
  Top 0.406: U$2.17_SCL2 13.97,51.1 14.03,51.16 15.35,51.16 15.83,50.68 15.83,49.38 | 15.83,49.38 15.83,47.92 R3.2 | 15.83,49.38 15.42,49.38 v15.02,48.98
  Bottom 0.305: v15.02,48.98 23.38,49.01 24.97,47.98 24.92,34.23 24.92,32.96 22.96,31 22.96,30.18 23.15,29.94 25.39,29.94 v25.36,29.1
N$18  (via drill 0.6)
  Top 0.305: v25.6,50.01 25.32,50.5 24.31,51.08 | IC1.12 24.06,29.69 v25.12,30.75
  Top 0.406: 23.47,51.17 U$2.2_TXD1 | U$2.2_TXD1 | 24.31,51.08 23.42,51.08 U$2.2_TXD1
  Bottom 0.305: v25.6,50.01 26.02,49.7 25.96,32.01 25.12,31.17 v25.12,30.75
N$19  (via drill 0.6)
  Top 0.305: IC1.13 23.26,30.16 v23.92,30.77
  Top 0.406: U$2.3_RXD1 23.45,52.15 24.88,52.15 v25.32,51.83
  Bottom 0.305: 25.1,51.82 24.6,51.21 24.49,51.21 24.49,49.06 24.67,49.06 25.49,48.24 25.43,32.37 23.83,30.72 v23.92,30.77
  Bottom 0.406: v25.32,51.83 25.1,51.82
N$20
  Top 0.305: LED2.C
  Top 0.406: R12.1 LED2.C
N$22
  Top 0.406: R11.1 LED1.C
N$23  (via drill 0.6)
  Top 0.305: v16.3,21.9 15.8,22.4 14.35,22.4 IC1.29
  Bottom 0.305: v16.3,21.9 15.42,22.78 8.61,22.83 3.11,17.31 JP1.2
N$25  (via drill 0.6)
  Top 0.305: v16.3,23.3 IC1.28
  Bottom 0.305: v16.3,23.3 14.5,23.3 8.52,23.36 8.29,23.26 7.75,22.75 4.9,19.85 JP1.1
N$27
  Top 0.305: IC1.17 20.06,30.06 21.96,34.21 30.14,34.21 JP2.6
N$28
  Top 0.305: IC1.16 20.86,29.88 22.49,33.67 28.51,33.66 28.64,33.66 29.9,32.4 29.9,31 31.1,29.8 JP2.5
N$29
  Top 0.305: IC1.15 21.66,29.75 23,33.1 28.2,33.1 29.3,32 29.3,29.9 30,29.2 30,28.5 31.3,27.2 31.93,27.2 JP2.4
N$30
  Top 0.305: 22.46,29.71 23.49,32.51 27.67,32.49 27.81,32.49 28.7,31.6 28.7,29.5 29.4,28.8 29.4,28.1 29.9,27.6 29.9,26.7 30.1,26.5 30.1,26.3 31.2,25.2 31.53,25.2 JP2.3
  Top 0.406: IC1.14 22.46,29.71
N$31
  Top 0.61: JP3.1 JP4.1
N$32
  Top 0.61: R14.1 17.35,6.85 20.3,3.9 20.3,3.03 JP4.2
N$33  (via drill 0.6)
  Top 0.305: v15.1,16.8 15.37,16.8 IC1.34
  Bottom 0.305: JP7.1 7.59,7.69 14.45,14.55 14.4,16.1 v15.1,16.8
N$35  (via drill 0.6)
  Top 0.305: S1.4 20.71,42.79 v21.5,42 | 16.8,17.55 IC1.35 | IC1.35 16.86,18.96 21.9,24 v21.9,24.7 | JP7.5 2.51,4.39 3.5,3.4 8.6,3.4 9.2,4 v9.2,7.4 | v15.7,15.8 16.2,15.8 16.9,16.3 16.9,17.45 IC1.35
  Top 0.406: S1.3 S1.4
  Bottom 0.305: v21.5,42 21.5,33.5 21.8,31.9 v21.9,24.7 | v9.2,7.4 9.2,8.5 15.1,14.4 15.1,15 v15.7,15.8
N$36  (via drill 0.6)
  Top 0.305: IC1.42 22.46,15.84 23.2,15.2 v23.8,14.7
  Bottom 0.305: v23.8,14.7 29.5,14.7 JP6.2
N$37  (via drill 0.6)
  Top 0.305: IC1.43 23.26,16.24 v24.1,15.9
  Bottom 0.305: v24.1,15.9 31.64,15.9 JP6.3
N$38
  Top 0.406: L2.2 9.65,54.88 JP8.2 12,57.5 U$2.11_RF_IN
N$39
  Top 0.406: L2.1 C12.1 R13.2
N$40
  Top 0.406: R13.1 11.5,47.5 12.5,48.5 12.5,54 13,54.5 U$2.14_VCC_RF
N$41
  Top 0.305: L1.2 20.37,15.58 C8.1
  Top 0.406: IC1.39 20.06,16.29 C8.1
NTXEN
  Top 0.305: IC1.23 14.38,27.41 14.38,29.82 14.19,30.01 13.65,30.01 12.6,30.86 12.44,30.96 12,31.4 12,32.17 R4.2
NTXTX  (via drill 0.6)
  Top 0.305: R5.2 11.39,44.2 v12.27,43.32 | v24.1,23.39 IC1.6
  Bottom 0.305: v12.27,43.32 19.61,34.82 19.92,34.01 21.05,31.67 21.08,30.36 21.08,23.91 v24.1,23.39
VBAT  (via drill 0.6)
  Top 0.305: 11.65,7.15 12.4,7.9 14.2,7.9 v15.4,9.1 15.3,9 R9.1 | v14.6,12.5 21.5,12.5 21.7,12.7 21.7,17.35 IC1.41
  Top 0.406: R8.1 11.65,7.15
  Bottom 0.305: v15.4,9.1 15.4,10.4 14.5,11.3 14.5,12.2 v14.6,12.5
VIN
  Top 0.61: R14.2 R8.2 13.35,6.25 11.8,4.7 11.8,3.07 JP3.2
VUSB  (via drill 0.6)
  Top 0.305: IC3.3 26.55,11.15 26.5,11.1 26.1,11.1 v22.6,13.25 22.55,12.8 22.15,11.9 16.3,11.9 15.65,11.25 R7.2 R10.1 | IC1.40 20.86,18.66 v21.7,19.5
  Bottom 0.305: v21.7,19.5 21.7,14.95 v22.6,13.25

### Text on the board
tPlace: 1 | Reset | DFU Boot | 1 | SPI | 1 | 1 | Super | ADC | GPIO | Track | 1 | ISP | RB | LB | LB | 1 | +B | - | +B | +R | + | -
bPlace: GPS | NTX2B | rlab.org.uk | SuperTrack V1.0 | RF